# Altium project Tipsy.PrjPcb
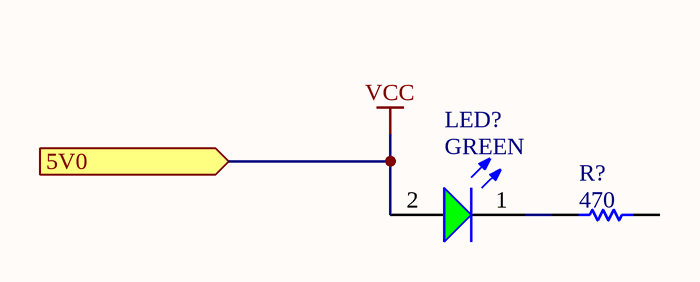
[diagram p0: Power.SchDoc]
5 sheets, 110 parts. Net scope: hierarchical (ports join the sheet entries above them; power ports are global).
Board file: PCB1.PcbDoc
Sheets:
  Power.SchDoc
  Top_Level.SchDoc
    Motor_Drivers = Motor_Drivers.SchDoc
      Motor_Driver_Channel0 = Motor_Driver_Channel.SchDoc
      Motor_Driver_Channel1 = Motor_Driver_Channel.SchDoc
      Motor_Driver_Channel2 = Motor_Driver_Channel.SchDoc
      Motor_Driver_Channel3 = Motor_Driver_Channel.SchDoc
      Motor_Driver_Channel4 = Motor_Driver_Channel.SchDoc
      Motor_Driver_Channel5 = Motor_Driver_Channel.SchDoc
      Motor_Driver_Channel6 = Motor_Driver_Channel.SchDoc
      Motor_Driver_Channel7 = Motor_Driver_Channel.SchDoc
      Motor_Driver_Channel8 = Motor_Driver_Channel.SchDoc
      Motor_Driver_Channel9 = Motor_Driver_Channel.SchDoc
      Motor_Driver_Channel10 = Motor_Driver_Channel.SchDoc
      Motor_Driver_Channel11 = Motor_Driver_Channel.SchDoc
      Motor_Driver_Channel12 = Motor_Driver_Channel.SchDoc
      Motor_Driver_Channel13 = Motor_Driver_Channel.SchDoc
      Motor_Driver_Channel14 = Motor_Driver_Channel.SchDoc
  PWM_Expander.SchDoc

## Sheet Power.SchDoc
size B; SheetNumber: 1; SheetTotal: 5

### Parts
(Parts that share a designator on the sheet are numbered #1, #2 ... from top to bottom, then left to right.)
LED?  GREEN  [WL-SMCW_0603_150060xx75000]
R?#1  470  [RESC1005X40X25LL05T10]

### Ports
5V0 (in)

### Nets
VCC: LED?.2(A) ; port 5V0
NetLED?_1: LED?.1(K) R?#1.1

Not connected (* = marked no-connect by the designer): R?#1 2

### Library data of the parts
LED? = CMP-1426-00006-7: WURTH ELEKTRONIK - 150060VS75000 - LED, Green, SMD, 0603, 30 mA, 2 V, 570 nm; Reverse Voltage: 5V; Power Dissipation: 72mW; Dominant Wavelength: 570nm; Peak Wavelength: 572nm; Forward Current: 100mA; Forward Voltage: 2V; Lens Style: Clear, Rectangular; Test Current: 20mA; Max Junction Temperature (Tj): 95°C; Viewing Angle: 140°; Luminous Intensity: 40mcd; Height: 700µm; Width: 800µm; Length: 1.6mm; Mount: Surface Mount; Min Operating Temperature: -40°C; Max Reverse Voltage (DC): 5V; Case Code (Imperial): 0603; Wavelength: 570nm; Color: Green; REACH SVHC: Unknown; RoHS: Compliant; Max Operating Temperature: 85°C; Packaging: Tape and Reel; Case/Package: 0603; Number of Pins: 2; Case Code (Metric): 1608
R?#1 = CMP-1011-00066-2: Part Number: RC0402JR-07470RL; Manufacturer: Yageo / Phycomp

## Sheet Top_Level.SchDoc
size C; SheetNumber: 2; SheetTotal: 5
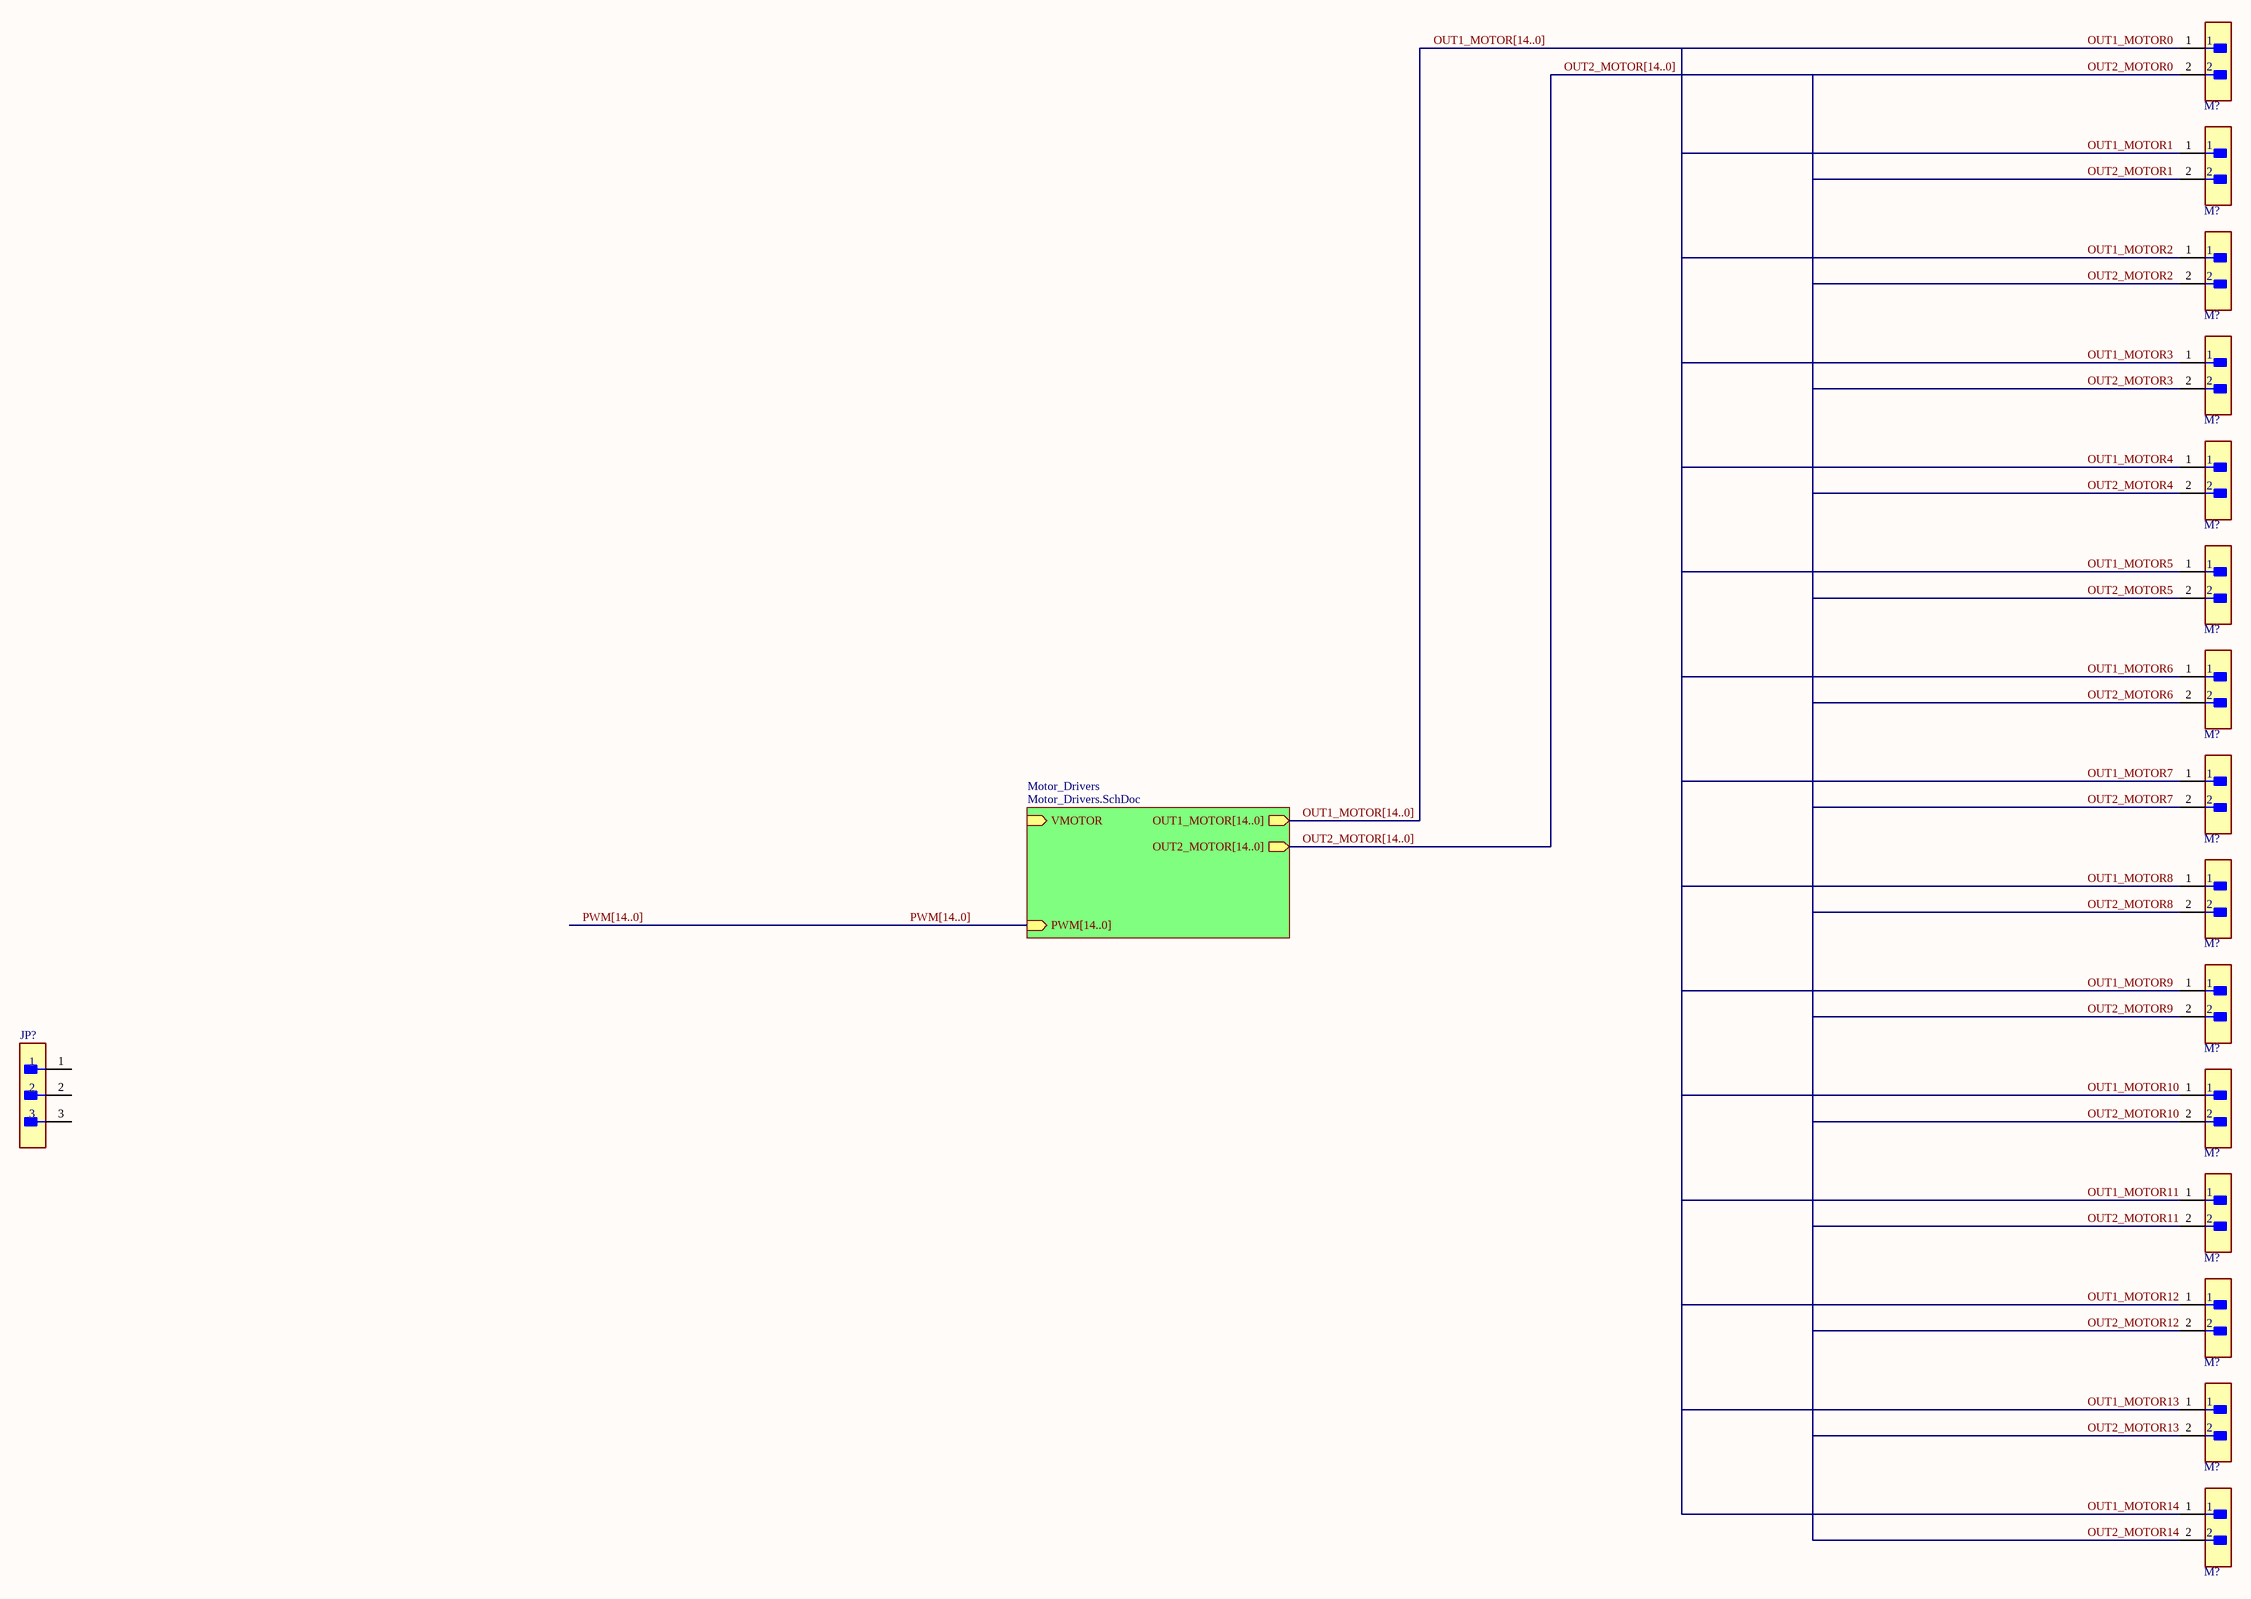
[diagram p1: Top_Level.SchDoc]

### Parts
(Parts that share a designator on the sheet are numbered #1, #2 ... from top to bottom, then left to right.)
JP?  B3B-XH-AM(LF)(SN)  [FP-B3B-XH-AM_LF_SN-MFG]  (value not drawn)
M?#1  B2B-EH-A(LF)(SN)  [FP-B2B-EH-A_LF_SN-MFG]  (value not drawn)
M?#2  B2B-EH-A(LF)(SN)  [FP-B2B-EH-A_LF_SN-MFG]  (value not drawn)
M?#3  B2B-EH-A(LF)(SN)  [FP-B2B-EH-A_LF_SN-MFG]  (value not drawn)
M?#4  B2B-EH-A(LF)(SN)  [FP-B2B-EH-A_LF_SN-MFG]  (value not drawn)
M?#5  B2B-EH-A(LF)(SN)  [FP-B2B-EH-A_LF_SN-MFG]  (value not drawn)
M?#6  B2B-EH-A(LF)(SN)  [FP-B2B-EH-A_LF_SN-MFG]  (value not drawn)
M?#7  B2B-EH-A(LF)(SN)  [FP-B2B-EH-A_LF_SN-MFG]  (value not drawn)
M?#8  B2B-EH-A(LF)(SN)  [FP-B2B-EH-A_LF_SN-MFG]  (value not drawn)
M?#9  B2B-EH-A(LF)(SN)  [FP-B2B-EH-A_LF_SN-MFG]  (value not drawn)
M?#10  B2B-EH-A(LF)(SN)  [FP-B2B-EH-A_LF_SN-MFG]  (value not drawn)
M?#11  B2B-EH-A(LF)(SN)  [FP-B2B-EH-A_LF_SN-MFG]  (value not drawn)
M?#12  B2B-EH-A(LF)(SN)  [FP-B2B-EH-A_LF_SN-MFG]  (value not drawn)
M?#13  B2B-EH-A(LF)(SN)  [FP-B2B-EH-A_LF_SN-MFG]  (value not drawn)
M?#14  B2B-EH-A(LF)(SN)  [FP-B2B-EH-A_LF_SN-MFG]  (value not drawn)
M?#15  B2B-EH-A(LF)(SN)  [FP-B2B-EH-A_LF_SN-MFG]  (value not drawn)

### Sub-sheets
Motor_Drivers = Motor_Drivers.SchDoc: VMOTOR (in), PWM[14..0] (in), OUT1_MOTOR[14..0] (out), OUT2_MOTOR[14..0] (out)

### Nets
OUT1_MOTOR0: M?#1.1  [project net MOTOR_OUT1]
OUT1_MOTOR1: M?#2.1  [project net MOTOR_OUT1]
OUT1_MOTOR2: M?#3.1  [project net MOTOR_OUT1]
OUT1_MOTOR3: M?#4.1  [project net MOTOR_OUT1]
OUT1_MOTOR4: M?#5.1  [project net MOTOR_OUT1]
OUT1_MOTOR5: M?#6.1  [project net MOTOR_OUT1]
OUT1_MOTOR6: M?#7.1  [project net MOTOR_OUT1]
OUT1_MOTOR7: M?#8.1  [project net MOTOR_OUT1]
OUT1_MOTOR8: M?#9.1  [project net MOTOR_OUT1]
OUT1_MOTOR9: M?#10.1  [project net MOTOR_OUT1]
OUT1_MOTOR10: M?#11.1  [project net MOTOR_OUT1]
OUT1_MOTOR11: M?#12.1  [project net MOTOR_OUT1]
OUT1_MOTOR12: M?#13.1  [project net MOTOR_OUT1]
OUT1_MOTOR13: M?#14.1  [project net MOTOR_OUT1]
OUT1_MOTOR14: M?#15.1  [project net MOTOR_OUT1]
OUT2_MOTOR0: M?#1.2  [project net MOTOR_OUT2]
OUT2_MOTOR1: M?#2.2  [project net MOTOR_OUT2]
OUT2_MOTOR2: M?#3.2  [project net MOTOR_OUT2]
OUT2_MOTOR3: M?#4.2  [project net MOTOR_OUT2]
OUT2_MOTOR4: M?#5.2  [project net MOTOR_OUT2]
OUT2_MOTOR5: M?#6.2  [project net MOTOR_OUT2]
OUT2_MOTOR6: M?#7.2  [project net MOTOR_OUT2]
OUT2_MOTOR7: M?#8.2  [project net MOTOR_OUT2]
OUT2_MOTOR8: M?#9.2  [project net MOTOR_OUT2]
OUT2_MOTOR9: M?#10.2  [project net MOTOR_OUT2]
OUT2_MOTOR10: M?#11.2  [project net MOTOR_OUT2]
OUT2_MOTOR11: M?#12.2  [project net MOTOR_OUT2]
OUT2_MOTOR12: M?#13.2  [project net MOTOR_OUT2]
OUT2_MOTOR13: M?#14.2  [project net MOTOR_OUT2]
OUT2_MOTOR14: M?#15.2  [project net MOTOR_OUT2]

Not connected (* = marked no-connect by the designer): JP? 1 2 3

### Buses and harness runs
bus OUT1_MOTOR[14..0] = sheet Motor_Drivers/OUT1_MOTOR[14..0]
bus OUT2_MOTOR[14..0] = sheet Motor_Drivers/OUT2_MOTOR[14..0]
bus PWM[14..0] = sheet Motor_Drivers/PWM[14..0]

### Library data of the parts
JP? = CMP-17438-000009-1: CONN HEADER VERT 3POS 2.5MM; Max Current Rating: 3A; Gender: Male; Max Voltage Rating (AC): 250V; Connector Type: Male Pin; Pitch: 0.098inch; Number of Positions: 3; Contact Resistance: 20mR; Termination: Press-Fit; Housing Color: White; Housing Material: Polyamide; Orientation: Straight; Contact Material: Brass; Contact Type: Male Pin; Color: Natural; Packaging: Bulk; Lead Free: Lead Free; Depth: 5.75mm; Number of Rows: 1; Contact Plating: Tin; Length: 9.9mm; Max Operating Temperature: 85°C; Series: XH; Min Operating Temperature: -25°C; Fastening Type: Detent; Mount: Through Hole
M?#1-M?#15 = CMP-17439-000026-1: CONN HEADER VERT 2POS 2.5MM; Number of Contacts: 2; Current Rating: 3A; Connector Type: Plug; Contact Resistance: 20mR; Gender: Male; Voltage Rating: 250V; Fastening Type: Detent; Depth: 3.8mm; Max Operating Temperature: 85°C; Orientation: Straight; Series: EH; Contact Plating: Tin; Min Operating Temperature: -25°C; Contact Type: Male Pin; Housing Color: White; Termination: Press-Fit; Housing Material: Nylon; Pitch: 2.5mm; Number of Positions: 2; Max Current Rating: 3A; Packaging: Bulk; Lead Free: Lead Free; Number of Rows: 1; Length: 7.5mm; Contact Mating Length: 0.13inch; Color: Natural; Max Voltage Rating (AC): 250V; Contact Material: Copper Alloy; Mount: Through Hole

## Sheet Motor_Drivers.SchDoc
size B; SheetNumber: 3; SheetTotal: 5
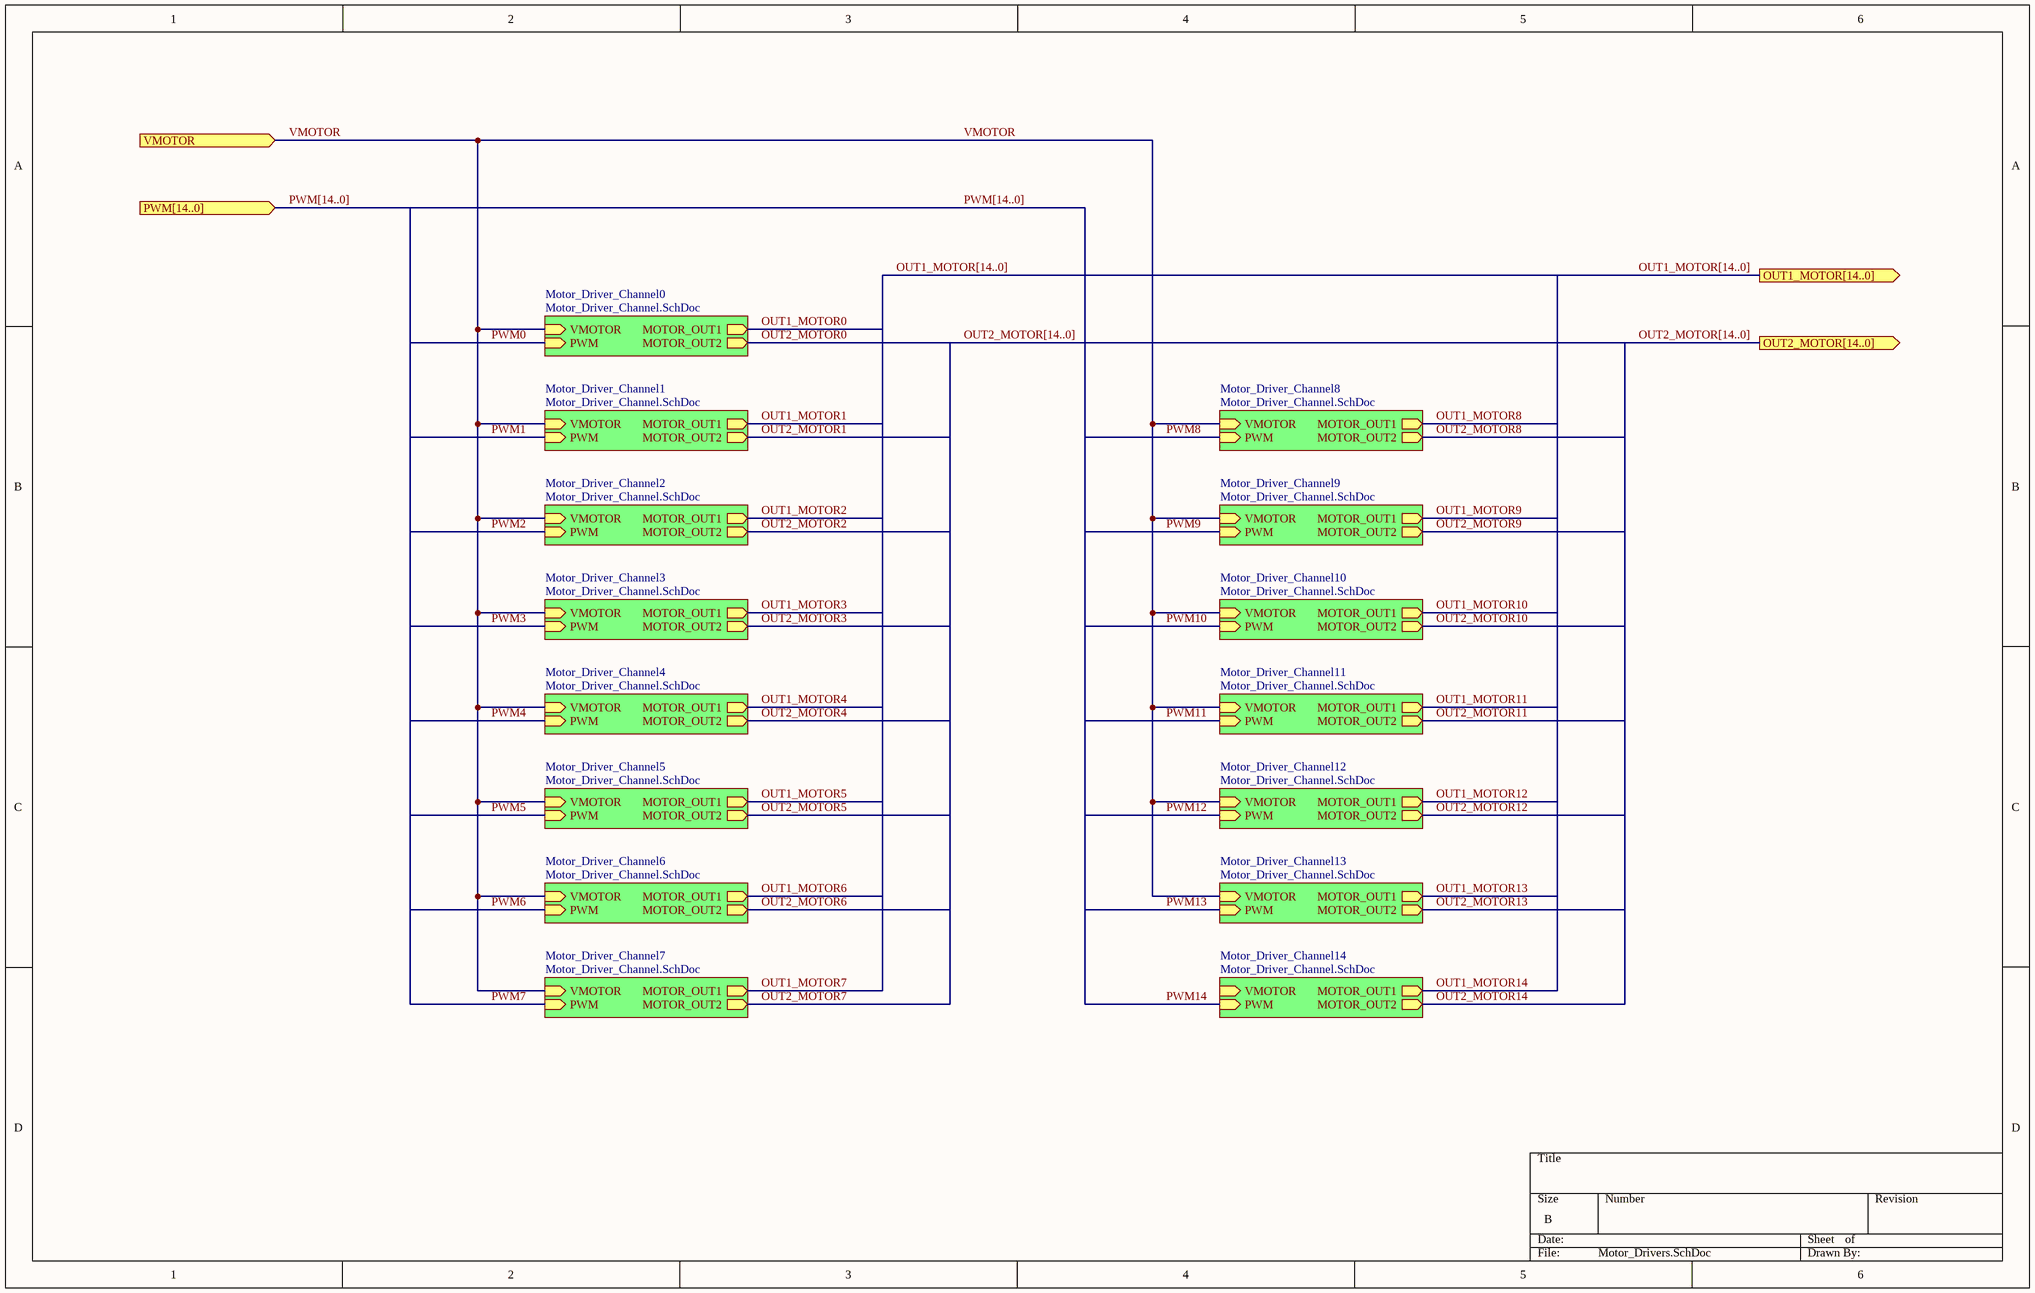
[diagram p2: Motor_Drivers.SchDoc]

### Sub-sheets
Motor_Driver_Channel0 = Motor_Driver_Channel.SchDoc: VMOTOR (in), PWM (in), MOTOR_OUT1 (out), MOTOR_OUT2 (out)
Motor_Driver_Channel1 = Motor_Driver_Channel.SchDoc: VMOTOR (in), PWM (in), MOTOR_OUT1 (out), MOTOR_OUT2 (out)
Motor_Driver_Channel2 = Motor_Driver_Channel.SchDoc: VMOTOR (in), PWM (in), MOTOR_OUT1 (out), MOTOR_OUT2 (out)
Motor_Driver_Channel3 = Motor_Driver_Channel.SchDoc: VMOTOR (in), PWM (in), MOTOR_OUT1 (out), MOTOR_OUT2 (out)
Motor_Driver_Channel4 = Motor_Driver_Channel.SchDoc: VMOTOR (in), PWM (in), MOTOR_OUT1 (out), MOTOR_OUT2 (out)
Motor_Driver_Channel5 = Motor_Driver_Channel.SchDoc: VMOTOR (in), PWM (in), MOTOR_OUT1 (out), MOTOR_OUT2 (out)
Motor_Driver_Channel6 = Motor_Driver_Channel.SchDoc: VMOTOR (in), PWM (in), MOTOR_OUT1 (out), MOTOR_OUT2 (out)
Motor_Driver_Channel7 = Motor_Driver_Channel.SchDoc: VMOTOR (in), PWM (in), MOTOR_OUT1 (out), MOTOR_OUT2 (out)
Motor_Driver_Channel8 = Motor_Driver_Channel.SchDoc: VMOTOR (in), PWM (in), MOTOR_OUT1 (out), MOTOR_OUT2 (out)
Motor_Driver_Channel9 = Motor_Driver_Channel.SchDoc: VMOTOR (in), PWM (in), MOTOR_OUT1 (out), MOTOR_OUT2 (out)
Motor_Driver_Channel10 = Motor_Driver_Channel.SchDoc: VMOTOR (in), PWM (in), MOTOR_OUT1 (out), MOTOR_OUT2 (out)
Motor_Driver_Channel11 = Motor_Driver_Channel.SchDoc: VMOTOR (in), PWM (in), MOTOR_OUT1 (out), MOTOR_OUT2 (out)
Motor_Driver_Channel12 = Motor_Driver_Channel.SchDoc: VMOTOR (in), PWM (in), MOTOR_OUT1 (out), MOTOR_OUT2 (out)
Motor_Driver_Channel13 = Motor_Driver_Channel.SchDoc: VMOTOR (in), PWM (in), MOTOR_OUT1 (out), MOTOR_OUT2 (out)
Motor_Driver_Channel14 = Motor_Driver_Channel.SchDoc: VMOTOR (in), PWM (in), MOTOR_OUT1 (out), MOTOR_OUT2 (out)

### Ports
OUT1_MOTOR[14..0] (out), OUT2_MOTOR[14..0] (out), PWM[14..0] (in), VMOTOR (in)

### Nets
VMOTOR: port VMOTOR, sheet Motor_Driver_Channel0/VMOTOR, sheet Motor_Driver_Channel1/VMOTOR, sheet Motor_Driver_Channel2/VMOTOR, sheet Motor_Driver_Channel3/VMOTOR, sheet Motor_Driver_Channel4/VMOTOR, sheet Motor_Driver_Channel5/VMOTOR, sheet Motor_Driver_Channel6/VMOTOR, sheet Motor_Driver_Channel7/VMOTOR, sheet Motor_Driver_Channel8/VMOTOR, sheet Motor_Driver_Channel9/VMOTOR, sheet Motor_Driver_Channel10/VMOTOR, sheet Motor_Driver_Channel11/VMOTOR, sheet Motor_Driver_Channel12/VMOTOR, sheet Motor_Driver_Channel13/VMOTOR

### Buses and harness runs
bus OUT1_MOTOR[14..0] = port OUT1_MOTOR[14..0]
bus OUT2_MOTOR[14..0] = port OUT2_MOTOR[14..0]
bus PWM[14..0] = port PWM[14..0]

## Sheet Motor_Driver_Channel.SchDoc
size C; SheetNumber: 3; SheetTotal: 4
Used 15 times, as channels Motor_Drivers/Motor_Driver_Channel0, Motor_Drivers/Motor_Driver_Channel1, Motor_Drivers/Motor_Driver_Channel2, Motor_Drivers/Motor_Driver_Channel3, Motor_Drivers/Motor_Driver_Channel4, Motor_Drivers/Motor_Driver_Channel5, Motor_Drivers/Motor_Driver_Channel6, Motor_Drivers/Motor_Driver_Channel7, Motor_Drivers/Motor_Driver_Channel8, Motor_Drivers/Motor_Driver_Channel9, Motor_Drivers/Motor_Driver_Channel10, Motor_Drivers/Motor_Driver_Channel11, Motor_Drivers/Motor_Driver_Channel12, Motor_Drivers/Motor_Driver_Channel13, Motor_Drivers/Motor_Driver_Channel14. Parts and nets are listed once, with the designators drawn on the sheet.
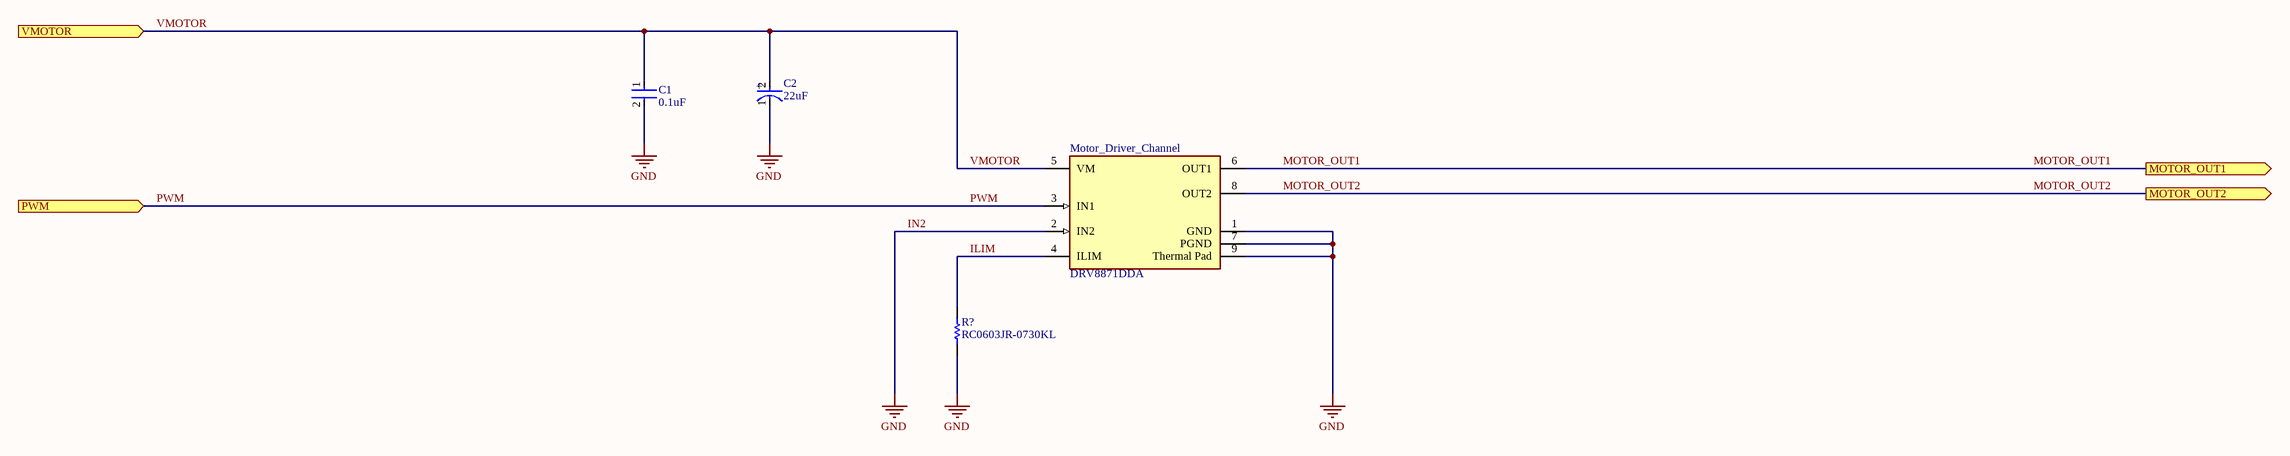
[diagram p3: Motor_Driver_Channel.SchDoc]

### Parts
C1  0.1uF  [FP-C0603C-CF-MFG]
C2  22uF  [FP-EEH-D8-MFG]
Motor_Driver_Channel  DRV8871DDA  [FP-DDA0008E-IPC_B]
R?  RC0603JR-0730KL  [RESC1608X55X25NL10T15]

### Ports
MOTOR_OUT1 (out), MOTOR_OUT2 (out), PWM (in), VMOTOR (in)

### Nets
IN2: C1.2 C2.1(C) Motor_Driver_Channel.1(GND) Motor_Driver_Channel.2(IN2) Motor_Driver_Channel.7(PGND) Motor_Driver_Channel.9(Thermal_Pad) R?.1  [also labelled GND]
ILIM: Motor_Driver_Channel.4(ILIM) R?.2
MOTOR_OUT1: Motor_Driver_Channel.6(OUT1) ; port MOTOR_OUT1
MOTOR_OUT2: Motor_Driver_Channel.8(OUT2) ; port MOTOR_OUT2
PWM: Motor_Driver_Channel.3(IN1) ; port PWM
VMOTOR: C1.1 C2.2(A) Motor_Driver_Channel.5(VM) ; port VMOTOR

### Channels
Motor_Drivers/Motor_Driver_Channel0: designators end in _Motor_Driver_Channel0; ports MOTOR_OUT1=MOTOR_OUT1 MOTOR_OUT2=MOTOR_OUT2 PWM=PWM_Motor_Driver_Channel0 VMOTOR=VMOTOR
Motor_Drivers/Motor_Driver_Channel1: designators end in _Motor_Driver_Channel1; ports MOTOR_OUT1=MOTOR_OUT1 MOTOR_OUT2=MOTOR_OUT2 PWM=PWM_Motor_Driver_Channel1 VMOTOR=VMOTOR
Motor_Drivers/Motor_Driver_Channel2: designators end in _Motor_Driver_Channel2; ports MOTOR_OUT1=MOTOR_OUT1 MOTOR_OUT2=MOTOR_OUT2 PWM=PWM_Motor_Driver_Channel2 VMOTOR=VMOTOR
Motor_Drivers/Motor_Driver_Channel3: designators end in _Motor_Driver_Channel3; ports MOTOR_OUT1=MOTOR_OUT1 MOTOR_OUT2=MOTOR_OUT2 PWM=PWM_Motor_Driver_Channel3 VMOTOR=VMOTOR
Motor_Drivers/Motor_Driver_Channel4: designators end in _Motor_Driver_Channel4; ports MOTOR_OUT1=MOTOR_OUT1 MOTOR_OUT2=MOTOR_OUT2 PWM=PWM_Motor_Driver_Channel4 VMOTOR=VMOTOR
Motor_Drivers/Motor_Driver_Channel5: designators end in _Motor_Driver_Channel5; ports MOTOR_OUT1=MOTOR_OUT1 MOTOR_OUT2=MOTOR_OUT2 PWM=PWM_Motor_Driver_Channel5 VMOTOR=VMOTOR
Motor_Drivers/Motor_Driver_Channel6: designators end in _Motor_Driver_Channel6; ports MOTOR_OUT1=MOTOR_OUT1 MOTOR_OUT2=MOTOR_OUT2 PWM=PWM_Motor_Driver_Channel6 VMOTOR=VMOTOR
Motor_Drivers/Motor_Driver_Channel7: designators end in _Motor_Driver_Channel7; ports MOTOR_OUT1=MOTOR_OUT1 MOTOR_OUT2=MOTOR_OUT2 PWM=PWM_Motor_Driver_Channel7 VMOTOR=VMOTOR
Motor_Drivers/Motor_Driver_Channel8: designators end in _Motor_Driver_Channel8; ports MOTOR_OUT1=MOTOR_OUT1 MOTOR_OUT2=MOTOR_OUT2 PWM=PWM_Motor_Driver_Channel8 VMOTOR=VMOTOR
Motor_Drivers/Motor_Driver_Channel9: designators end in _Motor_Driver_Channel9; ports MOTOR_OUT1=MOTOR_OUT1 MOTOR_OUT2=MOTOR_OUT2 PWM=PWM_Motor_Driver_Channel9 VMOTOR=VMOTOR
Motor_Drivers/Motor_Driver_Channel10: designators end in _Motor_Driver_Channel10; ports MOTOR_OUT1=MOTOR_OUT1 MOTOR_OUT2=MOTOR_OUT2 PWM=PWM_Motor_Driver_Channel10 VMOTOR=VMOTOR
Motor_Drivers/Motor_Driver_Channel11: designators end in _Motor_Driver_Channel11; ports MOTOR_OUT1=MOTOR_OUT1 MOTOR_OUT2=MOTOR_OUT2 PWM=PWM_Motor_Driver_Channel11 VMOTOR=VMOTOR
Motor_Drivers/Motor_Driver_Channel12: designators end in _Motor_Driver_Channel12; ports MOTOR_OUT1=MOTOR_OUT1 MOTOR_OUT2=MOTOR_OUT2 PWM=PWM_Motor_Driver_Channel12 VMOTOR=VMOTOR
Motor_Drivers/Motor_Driver_Channel13: designators end in _Motor_Driver_Channel13; ports MOTOR_OUT1=MOTOR_OUT1 MOTOR_OUT2=MOTOR_OUT2 PWM=PWM_Motor_Driver_Channel13 VMOTOR=VMOTOR
Motor_Drivers/Motor_Driver_Channel14: designators end in _Motor_Driver_Channel14; ports MOTOR_OUT1=MOTOR_OUT1 MOTOR_OUT2=MOTOR_OUT2 PWM=PWM_Motor_Driver_Channel14 VMOTOR=VMOTOR_Motor_Driver_Channel14

### Notes on the sheet
- (in symbol CMP-05428-000551-1) +

### Library data of the parts
C1 = CMP-2006-03061-2: CAP CER 0.1UF 50V X7R 0603; Manufacturer: KEMET; Manufacturer Part Number: C0603C104K5RACTU; Tolerance: 0.1; Temperature Coefficient: 30ppm/°C; Material: Ceramic; Automotive Grade: Grade 1; Value: 0.10 μF; Temperature: -55°C to +125°C; RoHS: TRUE; Temperature Range High: +125°C; Lead Free: Yes; Octopart: https://octopart.com/c0603c104k5ractu-kemet-139244; Digikey Description: CAP CER 0.1UF 50V X7R 0603; Category: Cap; Package: C0603C-CF; ComponentLink2Description: Datasheet; Temperature Range Low: -55°C; Device Class L1: Passive Components; Voltage Rating: 50 V; Automotive: Yes; Device Class L3: Ceramic Capacitors; ComponentLink2URL: https://api.kemet.com/component-edge/download/datasheet/C0603C100J5GACAUTO.pdf; Capacitance: 0.10 μF; Device Class L2: Capacitors; Temperature Characteristic: X7R; Height: 0.87mm
C2 = CMP-05428-000551-1: Conductive Polymer Hybrid Aluminum Electrolytic Capacitors 22uF ±20% 63V RADIAL SMT 6.3x7.7mm; Life (Hours): 4000Hour; Ripple Current (AC): 900mA; ESR (Equivalent Series Resistance): 80mR; Lead Diameter: 0.65mm; Leakage Current: 3uA; Mount: Surface Mount; Case/Package: Radial; Capacitance: 22uF; Height - Seated (Max): 0.315inch; Voltage Rating: 63V; Min Operating Temperature: -55°C; Lead Free: Lead Free; Tolerance: 20%; Package Quantity: 900; Resistor Type: Hybrid; Radiation Hardening: No; Material: Polymer; Height: 7.7mm; Series: ZC; Voltage: 63V; Ripple Current: 900mA; RoHS Compliant: Yes; Diameter: 6.3mm; Termination: SMD/SMT; Max Operating Temperature: 125°C; Voltage Rating (DC): 63V; Number of Pins: 8; REACH SVHC: No SVHC; Length: 7.7mm; Technology: HYBRID; Ratings: AEC-Q200; Packaging: Tape and Reel; Lead Pitch: 1.8mm
Motor_Driver_Channel = CMP-04915-000036-1: IC MOTOR DRVR UNIPLR 8SO PWRPAD; Interface: PWM; Output Current: 3.6A; Logic Function: AND GATE; Max Operating Temperature: 125°C; Packaging: Rail/Tube; Lead Free: Lead Free; Mount: Surface Mount; RoHS Compliant: Yes; Number of Pins: 8; Min Operating Temperature: -40°C
R? = CMP-2000-04263-1: Manufacturer: Yageo; Part Number: RC0603JR-0730KL

## Sheet PWM_Expander.SchDoc
size C; SheetNumber: 5; SheetTotal: 5
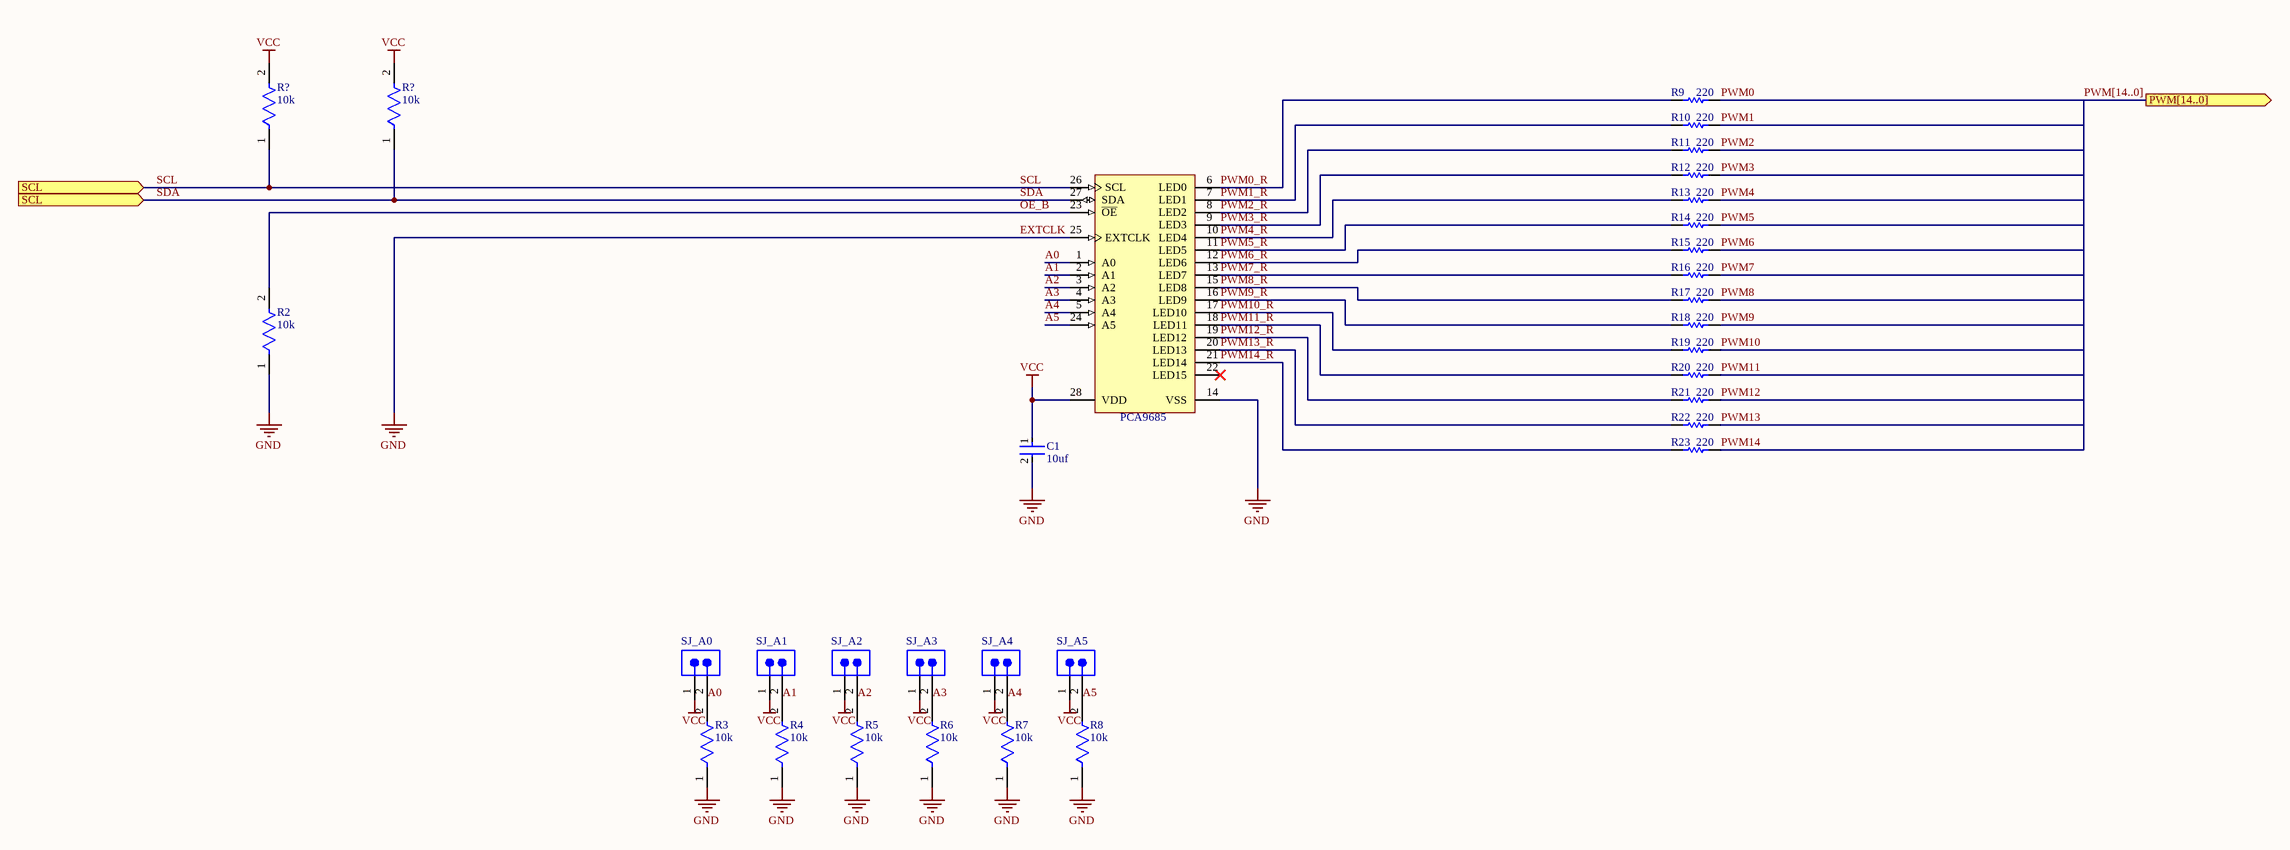
[diagram p4: PWM_Expander.SchDoc]

### Parts
(Parts that share a designator on the sheet are numbered #1, #2 ... from top to bottom, then left to right.)
?  PCA9685  [SOT361-1_V]
C1  10uf  [FP-GRM21B-0_1-MFG]
R2  10k  [FP-RC0402-0_4-IPC_C]
R3  10k  [FP-RC0402-0_4-IPC_C]
R4  10k  [FP-RC0402-0_4-IPC_C]
R5  10k  [FP-RC0402-0_4-IPC_C]
R6  10k  [FP-RC0402-0_4-IPC_C]
R7  10k  [FP-RC0402-0_4-IPC_C]
R8  10k  [FP-RC0402-0_4-IPC_C]
R9  220  [RESC1005X40X25ML05T10]
R10  220  [RESC1005X40X25ML05T10]
R11  220  [RESC1005X40X25ML05T10]
R12  220  [RESC1005X40X25ML05T10]
R13  220  [RESC1005X40X25ML05T10]
R14  220  [RESC1005X40X25ML05T10]
R15  220  [RESC1005X40X25ML05T10]
R16  220  [RESC1005X40X25ML05T10]
R17  220  [RESC1005X40X25ML05T10]
R18  220  [RESC1005X40X25ML05T10]
R19  220  [RESC1005X40X25ML05T10]
R20  220  [RESC1005X40X25ML05T10]
R21  220  [RESC1005X40X25ML05T10]
R22  220  [RESC1005X40X25ML05T10]
R23  220  [RESC1005X40X25ML05T10]
R?#2  10k  [FP-RC0402-0_4-IPC_C]
R?#3  10k  [FP-RC0402-0_4-IPC_C]
SJ_A0  61300211021  [61300211021]  (value not drawn)
SJ_A1  61300211021  [61300211021]  (value not drawn)
SJ_A2  61300211021  [61300211021]  (value not drawn)
SJ_A3  61300211021  [61300211021]  (value not drawn)
SJ_A4  61300211021  [61300211021]  (value not drawn)
SJ_A5  61300211021  [61300211021]  (value not drawn)

### Ports
PWM[14..0] (out), SCL (in)

### Nets
EXTCLK: ?.14(VSS) ?.25(EXTCLK) C1.2 R2.1 R3.1 R4.1 R5.1 R6.1 R7.1 R8.1  [also labelled GND]
VCC: ?.28(VDD) C1.1 R?#2.2 R?#3.2 SJ_A0.1 SJ_A1.1 SJ_A2.1 SJ_A3.1 SJ_A4.1 SJ_A5.1
A0: ?.1(A0) R3.2 SJ_A0.2
A1: ?.2(A1) R4.2 SJ_A1.2
A2: ?.3(A2) R5.2 SJ_A2.2
A3: ?.4(A3) R6.2 SJ_A3.2
A4: ?.5(A4) R7.2 SJ_A4.2
A5: ?.24(A5) R8.2 SJ_A5.2
OE_B: ?.23(~{OE}) R2.2
PWM0: R9.2  [also labelled PWM[14..0]]
PWM0_R: ?.6(LED0) R9.1
PWM1: R10.2
PWM1_R: ?.7(LED1) R10.1
PWM2: R11.2
PWM2_R: ?.8(LED2) R11.1
PWM3: R12.2
PWM3_R: ?.9(LED3) R12.1
PWM4: R13.2
PWM4_R: ?.10(LED4) R13.1
PWM5: R14.2
PWM5_R: ?.11(LED5) R14.1
PWM6: R15.2
PWM6_R: ?.12(LED6) R15.1
PWM7: R16.2
PWM7_R: ?.13(LED7) R16.1
PWM8: R17.2
PWM8_R: ?.15(LED8) R17.1
PWM9: R18.2
PWM9_R: ?.16(LED9) R18.1
PWM10: R19.2
PWM10_R: ?.17(LED10) R19.1
PWM11: R20.2
PWM11_R: ?.18(LED11) R20.1
PWM12: R21.2
PWM12_R: ?.19(LED12) R21.1
PWM13: R22.2
PWM13_R: ?.20(LED13) R22.1
PWM14: R23.2
PWM14_R: ?.21(LED14) R23.1
SCL: ?.26(SCL) ?.27(SDA) R?#2.1 R?#3.1 ; port SCL  [also labelled SDA]

Not connected (* = marked no-connect by the designer): ? 22(LED15)*

### Library data of the parts
? = CMP-1595-00004-2: 16-Channel, 12-Bit PWM Fm+ I2C-Bus LED Controller, 2.3 to 5.5 V, -40 to 85 degC, 28-Pin TSSOP (SOT361-1), RoHS, Tape and Reel; Supply Current Max: 10 mA; Supply Voltage Min: 2.3 V; Supply Voltage Max: 5.5 V; Frequency: 25000000 Hz; Temperature Min: -40 degC; PackageDescription: 28-Pin Small Outline Package, Body 9.7 x 4.4 mm, Pitch 0.65 mm; RoHS: TRUE; ComponentLink1Description: Manufacturer URL; Code_JEDEC: MO-153; PartNumber: PCA9685; ComponentLink2URL: http://www.nxp.com/documents/data_sheet/PCA9685.pdf; Packing: Tape and Reel; ComponentLink1URL: http://www.nxp.com/; ComponentLink3Description: Package Specification; ComponentLink2Description: Datasheet; ComponentLink3URL: http://www.nxp.com/documents/outline_drawing/sot361-1_po.pdf; DatasheetVersion: Rev. 4; Temperature Max: 85 degC; PackageVersion: 02/2003; Mounting Technology: Surface Mount
C1 = CMP-2007-03534-2: Chip Multilayer Ceramic Capacitors for General Purpose, 0805, 10uF, X5R, 15%, 10%, 16V; Case Code (Imperial): 0805; Packaging: Tape and Reel; Width: 0.049inch; Depth: 1.25mm; Voltage Rating: 16V; Height: 1.25mm; Case/Package: 0805; Max Operating Temperature: 85°C; Min Operating Temperature: -55°C; Tolerance: 10%; Dielectric: X5R; REACH SVHC: No SVHC; Mount: Surface Mount; Radiation Hardening: No; Case Code (Metric): 2012; Length: 2mm; Package Quantity: 10000; Voltage Rating (DC): 16V; Voltage: 16V; Capacitance: 10uF; Thickness: 0.053inch; Termination: SMD/SMT
R2-R8 R?#2 R?#3 = CMP-2002-07915-3: RES 10K OHM 5% 1/16W 0402; Max Power Dissipation: 63mW; Temperature Coefficient: 100ppm/°C; Power Rating: 62.5mW; Resistance: 10kR; Voltage Rating: 50V; Size Code: 0402; Resistance Tolerance: 5%; Packaging: Tape and Reel; Case Code (Metric): 1005; Lead Free: Lead Free; Resistor Type: Thick Film; Min Operating Temperature: -55°C; Military Standard: Not; Depth: 0.5mm; Series: RC; Case/Package: 0402; Construction: Rectangular; Number of Terminations: 2; Package Quantity: 1; Termination: SMD/SMT; Length: 0.039inch; Case Code (Imperial): 0402; Height: 0.016inch; Features: Moisture Resistant; RoHS Compliant: Yes; Max Operating Temperature: 155°C; Tolerance: 5%; Width: 0.02inch
R9-R23 = CMP-2002-08074-1: Manufacturer: Yageo; Part Number: RC0402JR-13220RL
SJ_A0-SJ_A5 = CMP-1502-01059-3: NexarPartId: 32855519; Gender: Male; Contact Resistance: 20mΩ; Operating Supply Voltage: 250V; Connector Type: Male Pin; Current Rating: 3A; Number of Contacts: 2; Pitch: 2.54mm; Termination: Solder; Number of Pins: 2; Number of Rows: 1; Contact Plating: Gold; Contact Material: Copper; REACH SVHC: Unknown; Mount: Through Hole; RoHS: Compliant; Color: Black; Packaging: Bulk; Contact Mating Length: 5.9944mm; Number of Positions: 2; Lead Pitch: 2.54mm

## Nets that join several sheets
EXTCLK: Motor_Drivers/Motor_Driver_Channel0 (7 pins), Motor_Drivers/Motor_Driver_Channel1 (7 pins), Motor_Drivers/Motor_Driver_Channel2 (7 pins), Motor_Drivers/Motor_Driver_Channel3 (7 pins), Motor_Drivers/Motor_Driver_Channel4 (7 pins), Motor_Drivers/Motor_Driver_Channel5 (7 pins), Motor_Drivers/Motor_Driver_Channel6 (7 pins), Motor_Drivers/Motor_Driver_Channel7 (7 pins), Motor_Drivers/Motor_Driver_Channel8 (7 pins), Motor_Drivers/Motor_Driver_Channel9 (7 pins), Motor_Drivers/Motor_Driver_Channel10 (7 pins), Motor_Drivers/Motor_Driver_Channel11 (7 pins), Motor_Drivers/Motor_Driver_Channel12 (7 pins), Motor_Drivers/Motor_Driver_Channel13 (7 pins), Motor_Drivers/Motor_Driver_Channel14 (7 pins), PWM_Expander (10 pins)
VCC: Power (LED?.2), PWM_Expander (10 pins)
MOTOR_OUT1: Top_Level (M?#1.1), Motor_Drivers/Motor_Driver_Channel0 (Motor_Driver_Channel_Motor_Driver_Channel0.6)
MOTOR_OUT1: Top_Level (M?#2.1), Motor_Drivers/Motor_Driver_Channel1 (Motor_Driver_Channel_Motor_Driver_Channel1.6)
MOTOR_OUT1: Top_Level (M?#3.1), Motor_Drivers/Motor_Driver_Channel2 (Motor_Driver_Channel_Motor_Driver_Channel2.6)
MOTOR_OUT1: Top_Level (M?#4.1), Motor_Drivers/Motor_Driver_Channel3 (Motor_Driver_Channel_Motor_Driver_Channel3.6)
MOTOR_OUT1: Top_Level (M?#5.1), Motor_Drivers/Motor_Driver_Channel4 (Motor_Driver_Channel_Motor_Driver_Channel4.6)
MOTOR_OUT1: Top_Level (M?#6.1), Motor_Drivers/Motor_Driver_Channel5 (Motor_Driver_Channel_Motor_Driver_Channel5.6)
MOTOR_OUT1: Top_Level (M?#7.1), Motor_Drivers/Motor_Driver_Channel6 (Motor_Driver_Channel_Motor_Driver_Channel6.6)
MOTOR_OUT1: Top_Level (M?#8.1), Motor_Drivers/Motor_Driver_Channel7 (Motor_Driver_Channel_Motor_Driver_Channel7.6)
MOTOR_OUT1: Top_Level (M?#9.1), Motor_Drivers/Motor_Driver_Channel8 (Motor_Driver_Channel_Motor_Driver_Channel8.6)
MOTOR_OUT1: Top_Level (M?#10.1), Motor_Drivers/Motor_Driver_Channel9 (Motor_Driver_Channel_Motor_Driver_Channel9.6)
MOTOR_OUT1: Top_Level (M?#11.1), Motor_Drivers/Motor_Driver_Channel10 (Motor_Driver_Channel_Motor_Driver_Channel10.6)
MOTOR_OUT1: Top_Level (M?#12.1), Motor_Drivers/Motor_Driver_Channel11 (Motor_Driver_Channel_Motor_Driver_Channel11.6)
MOTOR_OUT1: Top_Level (M?#13.1), Motor_Drivers/Motor_Driver_Channel12 (Motor_Driver_Channel_Motor_Driver_Channel12.6)
MOTOR_OUT1: Top_Level (M?#14.1), Motor_Drivers/Motor_Driver_Channel13 (Motor_Driver_Channel_Motor_Driver_Channel13.6)
MOTOR_OUT1: Top_Level (M?#15.1), Motor_Drivers/Motor_Driver_Channel14 (Motor_Driver_Channel_Motor_Driver_Channel14.6)
MOTOR_OUT2: Top_Level (M?#1.2), Motor_Drivers/Motor_Driver_Channel0 (Motor_Driver_Channel_Motor_Driver_Channel0.8)
MOTOR_OUT2: Top_Level (M?#2.2), Motor_Drivers/Motor_Driver_Channel1 (Motor_Driver_Channel_Motor_Driver_Channel1.8)
MOTOR_OUT2: Top_Level (M?#3.2), Motor_Drivers/Motor_Driver_Channel2 (Motor_Driver_Channel_Motor_Driver_Channel2.8)
MOTOR_OUT2: Top_Level (M?#4.2), Motor_Drivers/Motor_Driver_Channel3 (Motor_Driver_Channel_Motor_Driver_Channel3.8)
MOTOR_OUT2: Top_Level (M?#5.2), Motor_Drivers/Motor_Driver_Channel4 (Motor_Driver_Channel_Motor_Driver_Channel4.8)
MOTOR_OUT2: Top_Level (M?#6.2), Motor_Drivers/Motor_Driver_Channel5 (Motor_Driver_Channel_Motor_Driver_Channel5.8)
MOTOR_OUT2: Top_Level (M?#7.2), Motor_Drivers/Motor_Driver_Channel6 (Motor_Driver_Channel_Motor_Driver_Channel6.8)
MOTOR_OUT2: Top_Level (M?#8.2), Motor_Drivers/Motor_Driver_Channel7 (Motor_Driver_Channel_Motor_Driver_Channel7.8)
MOTOR_OUT2: Top_Level (M?#9.2), Motor_Drivers/Motor_Driver_Channel8 (Motor_Driver_Channel_Motor_Driver_Channel8.8)
MOTOR_OUT2: Top_Level (M?#10.2), Motor_Drivers/Motor_Driver_Channel9 (Motor_Driver_Channel_Motor_Driver_Channel9.8)
MOTOR_OUT2: Top_Level (M?#11.2), Motor_Drivers/Motor_Driver_Channel10 (Motor_Driver_Channel_Motor_Driver_Channel10.8)
MOTOR_OUT2: Top_Level (M?#12.2), Motor_Drivers/Motor_Driver_Channel11 (Motor_Driver_Channel_Motor_Driver_Channel11.8)
MOTOR_OUT2: Top_Level (M?#13.2), Motor_Drivers/Motor_Driver_Channel12 (Motor_Driver_Channel_Motor_Driver_Channel12.8)
MOTOR_OUT2: Top_Level (M?#14.2), Motor_Drivers/Motor_Driver_Channel13 (Motor_Driver_Channel_Motor_Driver_Channel13.8)
MOTOR_OUT2: Top_Level (M?#15.2), Motor_Drivers/Motor_Driver_Channel14 (Motor_Driver_Channel_Motor_Driver_Channel14.8)
VMOTOR: Motor_Drivers/Motor_Driver_Channel0 (C1_Motor_Driver_Channel0.1 C2_Motor_Driver_Channel0.2 Motor_Driver_Channel_Motor_Driver_Channel0.5), Motor_Drivers/Motor_Driver_Channel1 (C1_Motor_Driver_Channel1.1 C2_Motor_Driver_Channel1.2 Motor_Driver_Channel_Motor_Driver_Channel1.5), Motor_Drivers/Motor_Driver_Channel2 (C1_Motor_Driver_Channel2.1 C2_Motor_Driver_Channel2.2 Motor_Driver_Channel_Motor_Driver_Channel2.5), Motor_Drivers/Motor_Driver_Channel3 (C1_Motor_Driver_Channel3.1 C2_Motor_Driver_Channel3.2 Motor_Driver_Channel_Motor_Driver_Channel3.5), Motor_Drivers/Motor_Driver_Channel4 (C1_Motor_Driver_Channel4.1 C2_Motor_Driver_Channel4.2 Motor_Driver_Channel_Motor_Driver_Channel4.5), Motor_Drivers/Motor_Driver_Channel5 (C1_Motor_Driver_Channel5.1 C2_Motor_Driver_Channel5.2 Motor_Driver_Channel_Motor_Driver_Channel5.5), Motor_Drivers/Motor_Driver_Channel6 (C1_Motor_Driver_Channel6.1 C2_Motor_Driver_Channel6.2 Motor_Driver_Channel_Motor_Driver_Channel6.5), Motor_Drivers/Motor_Driver_Channel7 (C1_Motor_Driver_Channel7.1 C2_Motor_Driver_Channel7.2 Motor_Driver_Channel_Motor_Driver_Channel7.5), Motor_Drivers/Motor_Driver_Channel8 (C1_Motor_Driver_Channel8.1 C2_Motor_Driver_Channel8.2 Motor_Driver_Channel_Motor_Driver_Channel8.5), Motor_Drivers/Motor_Driver_Channel9 (C1_Motor_Driver_Channel9.1 C2_Motor_Driver_Channel9.2 Motor_Driver_Channel_Motor_Driver_Channel9.5), Motor_Drivers/Motor_Driver_Channel10 (C1_Motor_Driver_Channel10.1 C2_Motor_Driver_Channel10.2 Motor_Driver_Channel_Motor_Driver_Channel10.5), Motor_Drivers/Motor_Driver_Channel11 (C1_Motor_Driver_Channel11.1 C2_Motor_Driver_Channel11.2 Motor_Driver_Channel_Motor_Driver_Channel11.5), Motor_Drivers/Motor_Driver_Channel12 (C1_Motor_Driver_Channel12.1 C2_Motor_Driver_Channel12.2 Motor_Driver_Channel_Motor_Driver_Channel12.5), Motor_Drivers/Motor_Driver_Channel13 (C1_Motor_Driver_Channel13.1 C2_Motor_Driver_Channel13.2 Motor_Driver_Channel_Motor_Driver_Channel13.5)